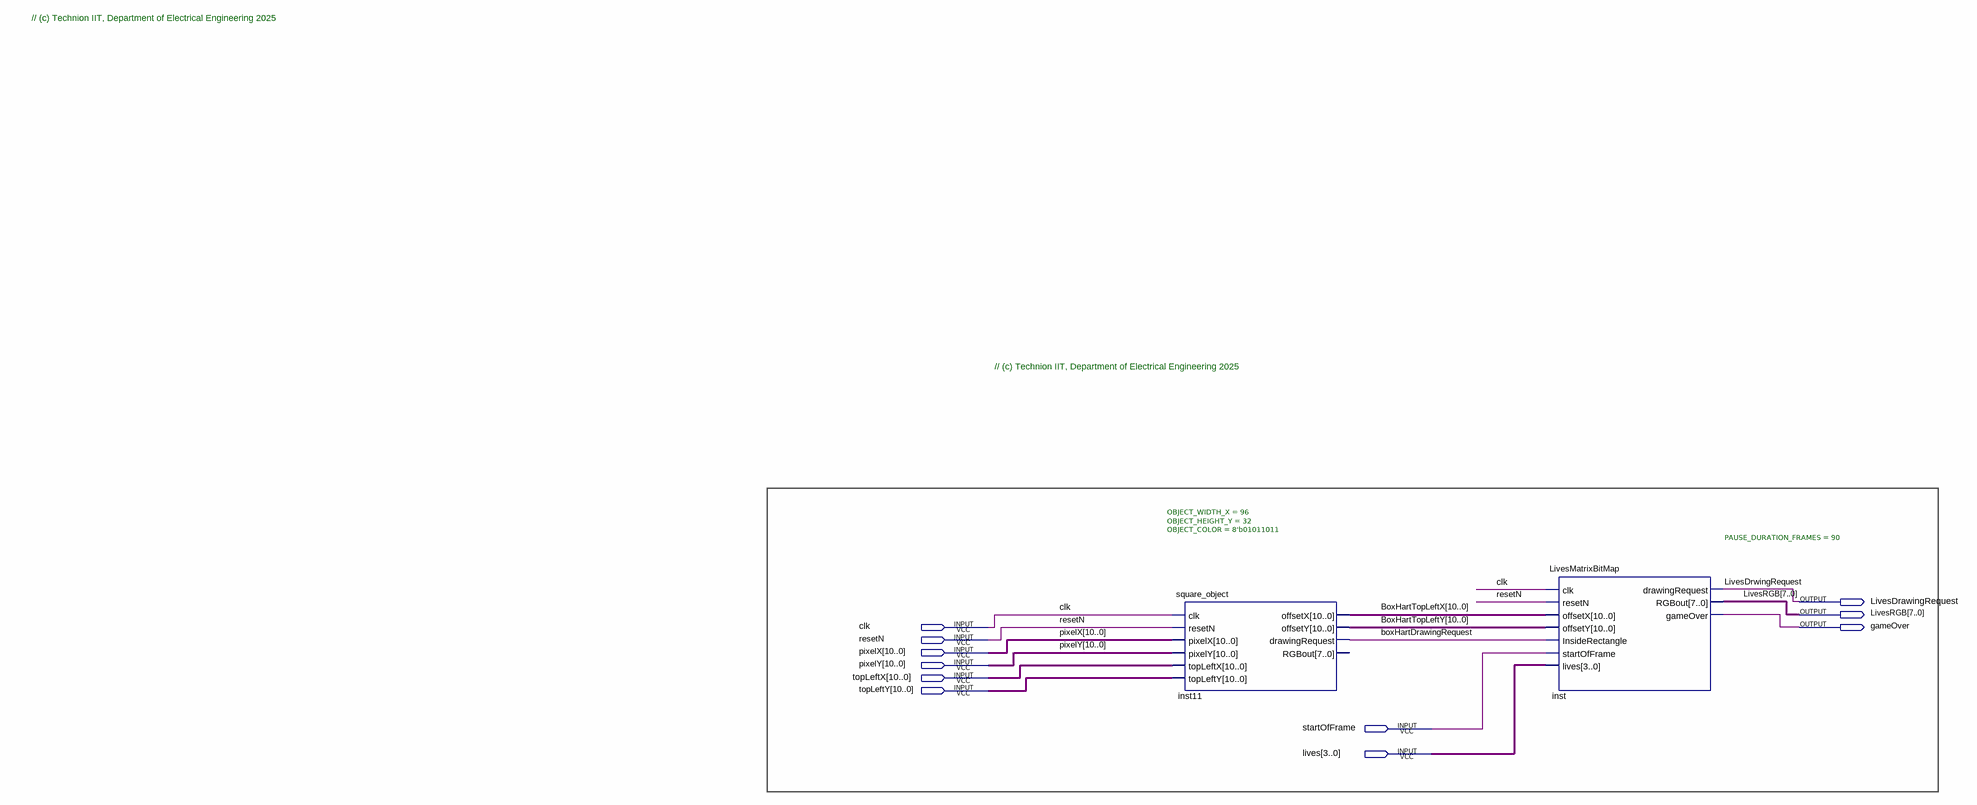
[diagram p0: schematic sheet]
// Quartus schematic lives_display.bdf as structural Verilog: 2 symbols, 11 pins
module lives_display (
  input  clk,
  input  resetN,
  input  [10:0] pixelX,
  input  [10:0] pixelY,
  input  [10:0] topLeftX,
  input  [10:0] topLeftY,
  input  startOfFrame,
  input  [3:0] lives,
  output LivesDrawingRequest,
  output [7:0] LivesRGB,
  output gameOver
);

  wire boxHartDrawingRequest;
  wire [10:0] BoxHartTopLeftX, BoxHartTopLeftY;

  square_object #(.OBJECT_WIDTH_X(96), .OBJECT_HEIGHT_Y(32), .OBJECT_COLOR(8'b01011011)) inst11 (
    .clk(clk), .resetN(resetN), .pixelX(pixelX), .pixelY(pixelY), .topLeftX(topLeftX), .topLeftY(topLeftY),
    .offsetX(BoxHartTopLeftX), .offsetY(BoxHartTopLeftY), .drawingRequest(boxHartDrawingRequest));  // open: RGBout
  LivesMatrixBitMap #(.PAUSE_DURATION_FRAMES(90)) inst (
    .clk(clk), .resetN(resetN), .offsetX(BoxHartTopLeftX), .offsetY(BoxHartTopLeftY),
    .InsideRectangle(boxHartDrawingRequest), .startOfFrame(startOfFrame), .lives(lives),
    .drawingRequest(LivesDrawingRequest), .RGBout(LivesRGB), .gameOver(gameOver));

  // Other names for the same wires on the sheet: LivesDrwingRequest = LivesDrawingRequest

  // Notes on the sheet:
  //   // (c) Technion IIT, Department of Electrical Engineering 2025
  //   // (c) Technion IIT, Department of Electrical Engineering 2025
endmodule
